# Altium schematic sheet OIS_Anakart.SchDoc
size A2
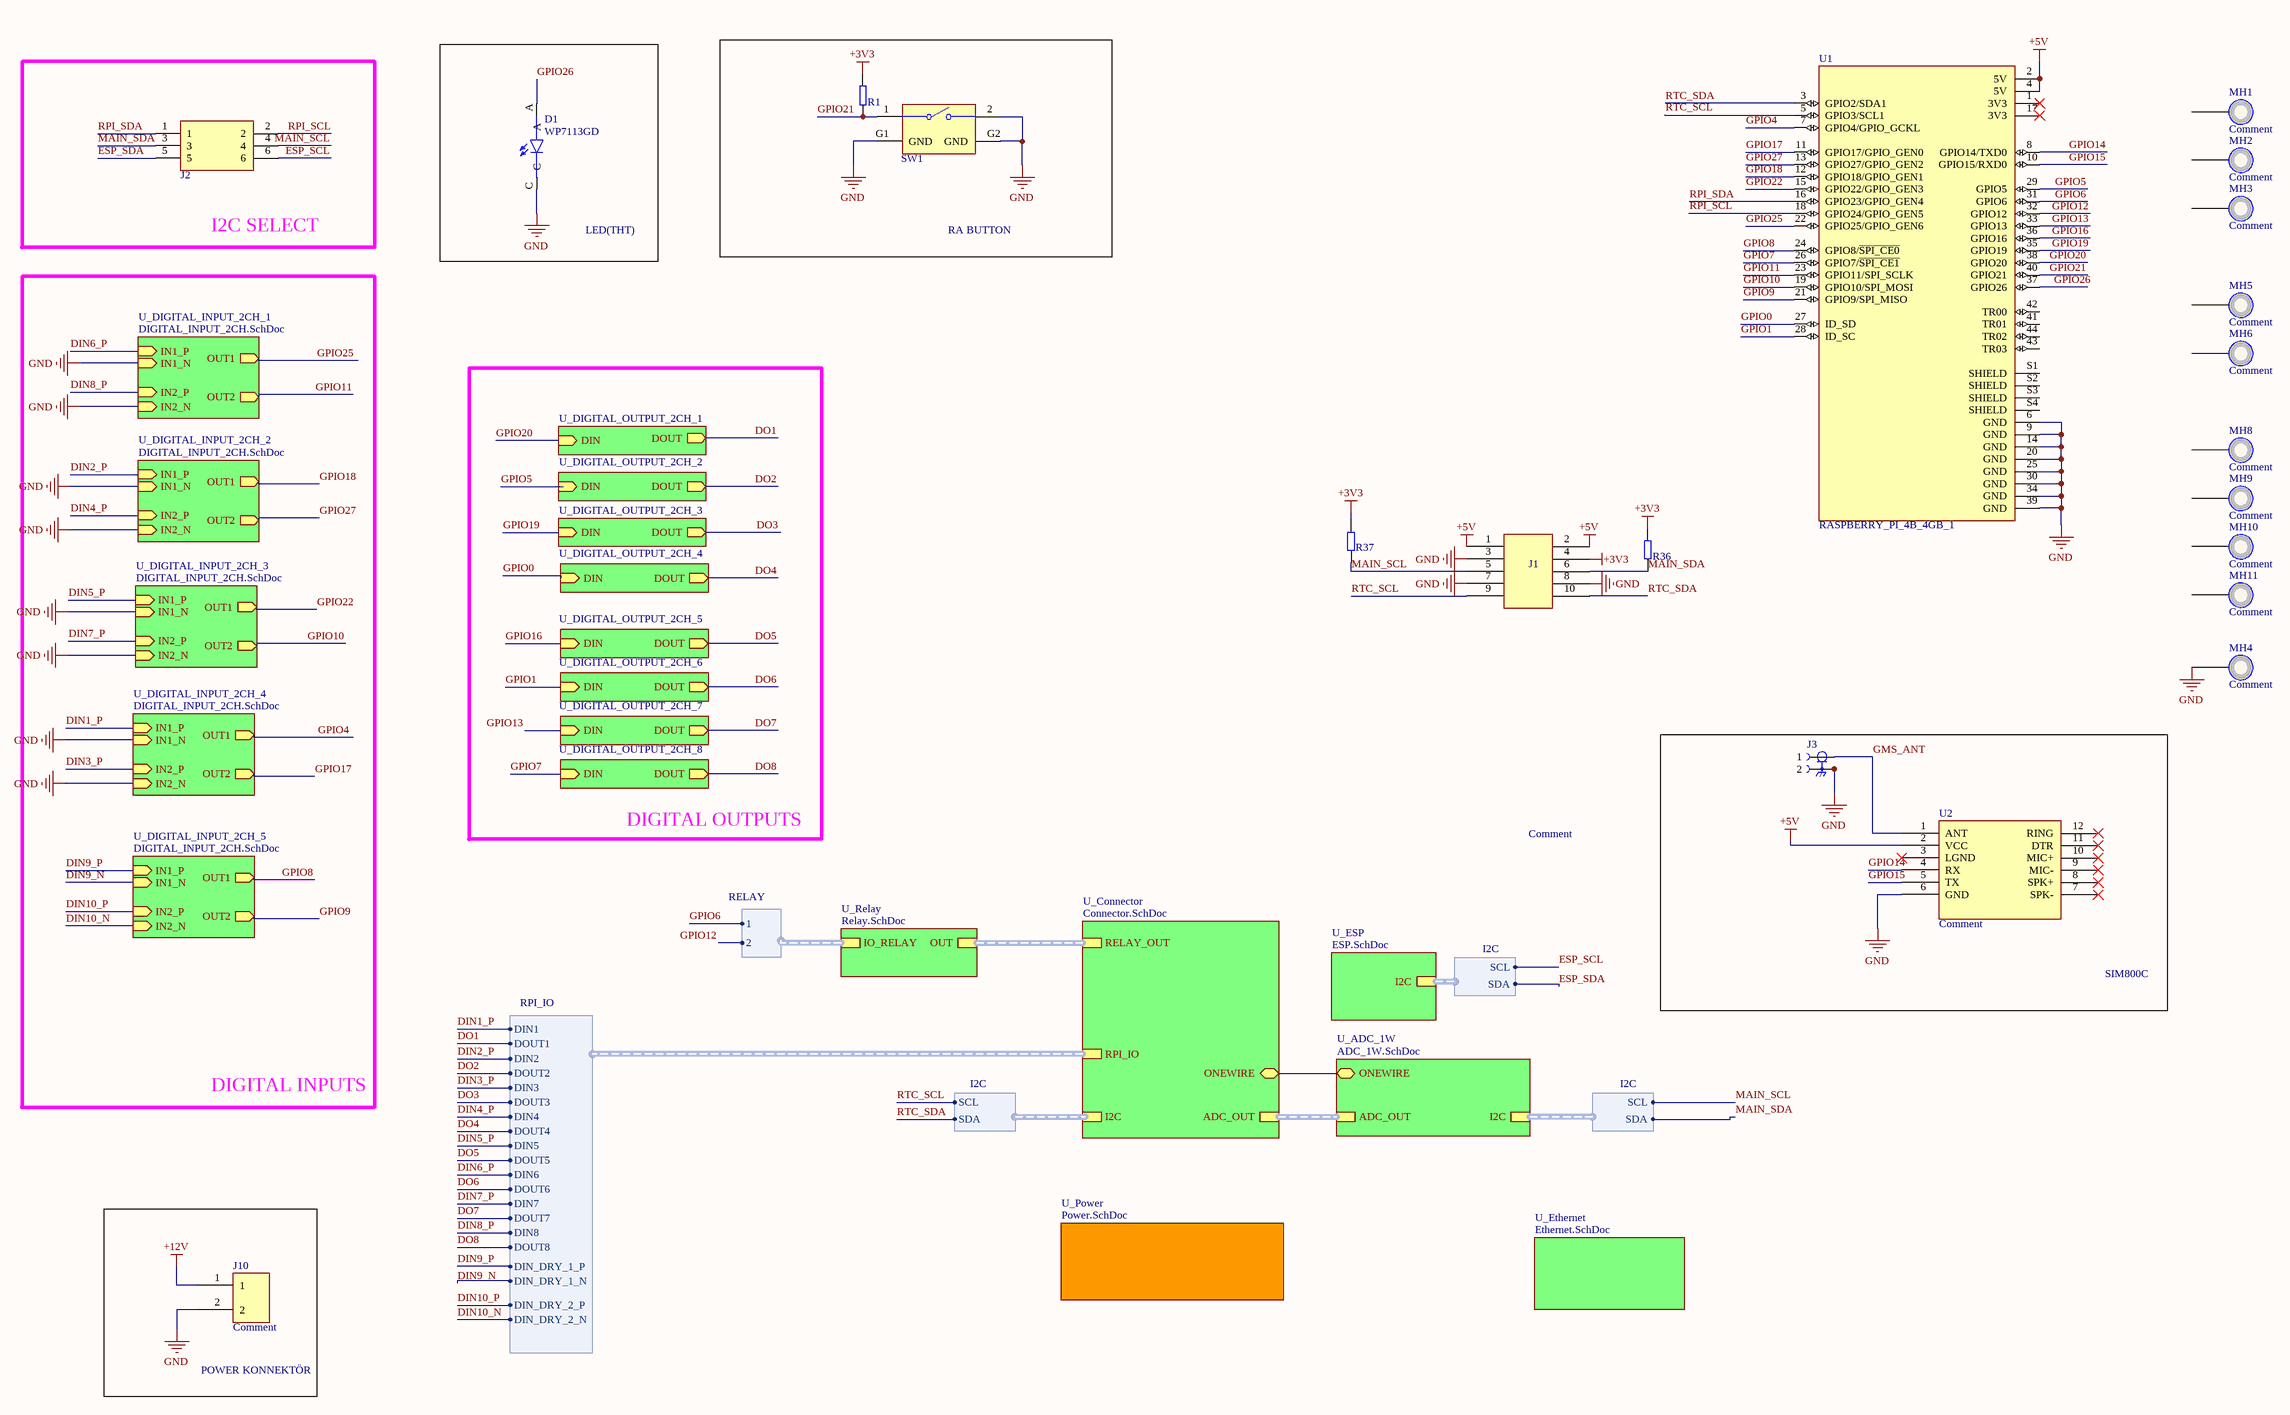
[diagram p0: OIS_Anakart.SchDoc]

## Parts
D1  WP7113GD  [LED_WP7113GD]
J1  Comment  [2.54_5x2P]
J2  GRPB032VWQS-RC  [CONN_6P_1.27MM]  (value not drawn)
J3  RF2-49B-T-00-50-G-HDW  [ADAMTECH_RF2-49B-T-00-50-G-HDW]  (value not drawn)
J10  Comment  [691213510002]
MH1  Comment  [m3_3.2x6]  (no BOM)
MH2  Comment  [m3_3.2x6]  (no BOM)
MH3  Comment  [m3_3.2x6]  (no BOM)
MH4  Comment  [m3_3.2x6]  (no BOM)
MH5  Comment  [m3_3.2x6]  (no BOM)
MH6  Comment  [m3_3.2x6]  (no BOM)
MH8  Comment  [m3_3.2x6]  (no BOM)
MH9  Comment  [m3_3.2x6]  (no BOM)
MH10  Comment  [m3_3.2x6]  (no BOM)
MH11  Comment  [m3_3.2x6]  (no BOM)
R1  1K  [R0402]  (value not drawn)
R36  1K  [R0402]  (value not drawn)
R37  1K  [R0402]  (value not drawn)
SW1  431256083716  [4312560837x6]  (value not drawn)
U1  RASPBERRY_PI_4B_4GB_1  [MODULE_RASPBERRY_PI_4B_4GB_2]
U2  Comment  [SIM800C_EVAL]

## Blocks framed on the sheet
I2C SELECT: J2
LED(THT): D1
RA BUTTON: R1 SW1
SIM800C: J3 U2
POWER KONNEKTÖR: J10

## Sub-sheets
U_ADC_1W = ADC_1W.SchDoc: I2C (harness I2C), ADC_OUT (harness ADC_OUT), ONEWIRE (bidir)
U_Connector = Connector.SchDoc: RELAY_OUT (harness RELAY_OUT), ADC_OUT (harness ADC_OUT), ONEWIRE (bidir), I2C (harness I2C), RPI_IO (harness RPI_IO)
U_DIGITAL_INPUT_2CH_1 = DIGITAL_INPUT_2CH.SchDoc: OUT2 (out), OUT1 (out), IN2_N (in), IN2_P (in), IN1_N (in), IN1_P (in)
U_DIGITAL_INPUT_2CH_2 = DIGITAL_INPUT_2CH.SchDoc: OUT2 (out), OUT1 (out), IN2_N (in), IN2_P (in), IN1_N (in), IN1_P (in)
U_DIGITAL_INPUT_2CH_3 = DIGITAL_INPUT_2CH.SchDoc: OUT2 (out), OUT1 (out), IN2_N (in), IN2_P (in), IN1_N (in), IN1_P (in)
U_DIGITAL_INPUT_2CH_4 = DIGITAL_INPUT_2CH.SchDoc: OUT2 (out), OUT1 (out), IN2_N (in), IN2_P (in), IN1_N (in), IN1_P (in)
U_DIGITAL_INPUT_2CH_5 = DIGITAL_INPUT_2CH.SchDoc: OUT2 (out), OUT1 (out), IN2_N (in), IN2_P (in), IN1_N (in), IN1_P (in)
U_DIGITAL_OUTPUT_2CH_1 = DIGITAL_OUTPUT_2CH.SchDoc: DIN (in), DOUT (out)
U_DIGITAL_OUTPUT_2CH_2 = DIGITAL_OUTPUT_2CH.SchDoc: DIN (in), DOUT (out)
U_DIGITAL_OUTPUT_2CH_3 = DIGITAL_OUTPUT_2CH.SchDoc: DIN (in), DOUT (out)
U_DIGITAL_OUTPUT_2CH_4 = DIGITAL_OUTPUT_2CH.SchDoc: DIN (in), DOUT (out)
U_DIGITAL_OUTPUT_2CH_5 = DIGITAL_OUTPUT_2CH.SchDoc: DIN (in), DOUT (out)
U_DIGITAL_OUTPUT_2CH_6 = DIGITAL_OUTPUT_2CH.SchDoc: DIN (in), DOUT (out)
U_DIGITAL_OUTPUT_2CH_7 = DIGITAL_OUTPUT_2CH.SchDoc: DIN (in), DOUT (out)
U_DIGITAL_OUTPUT_2CH_8 = DIGITAL_OUTPUT_2CH.SchDoc: DIN (in), DOUT (out)
U_ESP = ESP.SchDoc: I2C (harness I2C)
U_Ethernet = Ethernet.SchDoc: no entries
U_Power = Power.SchDoc: no entries
U_Relay = Relay.SchDoc: IO_RELAY (harness RELAY), OUT (harness RELAY_OUT)

## Harnesses
I2C: SCL, SDA
RPI_IO: DIN1, DOUT1, DIN2, DOUT2, DIN3, DOUT3, DIN4, DOUT4, DIN5, DOUT5, DIN6, DOUT6, DIN7, DOUT7, DIN8, DOUT8, DIN_DRY_1_P, DIN_DRY_1_N, DIN_DRY_2_N, DIN_DRY_2_P
RELAY: 2, 1

## Nets
+3V3: J1.4 R1.1 R36.1 R37.1
+5V: J1.1 J1.2 U1.2(5V) U1.4(5V) U2.2(VCC)
+12V: J10.1
GND: D1.C J1.3 J1.7 J1.8 J3.SH1 J3.SH2 J3.SH3 J3.SH4(2) J10.2 MH4.1 SW1.2 SW1.G1(GND) SW1.G2(GND) U1.6(GND) U1.9(GND) U1.14(GND) U1.20(GND) U1.25(GND) U1.30(GND) U1.34(GND) U1.39(GND) U2.6(GND) ; sheet U_DIGITAL_INPUT_2CH_1/IN2_N, sheet U_DIGITAL_INPUT_2CH_1/IN1_N, sheet U_DIGITAL_INPUT_2CH_2/IN2_N, sheet U_DIGITAL_INPUT_2CH_2/IN1_N, sheet U_DIGITAL_INPUT_2CH_3/IN2_N, sheet U_DIGITAL_INPUT_2CH_3/IN1_N, sheet U_DIGITAL_INPUT_2CH_4/IN2_N, sheet U_DIGITAL_INPUT_2CH_4/IN1_N
DIN1_P: sheet U_DIGITAL_INPUT_2CH_4/IN1_P, sheet U_Connector/RPI_IO.DIN1
DIN2_P: sheet U_DIGITAL_INPUT_2CH_2/IN1_P, sheet U_Connector/RPI_IO.DIN2
DIN3_P: sheet U_DIGITAL_INPUT_2CH_4/IN2_P, sheet U_Connector/RPI_IO.DIN3
DIN4_P: sheet U_DIGITAL_INPUT_2CH_2/IN2_P, sheet U_Connector/RPI_IO.DIN4
DIN5_P: sheet U_DIGITAL_INPUT_2CH_3/IN1_P, sheet U_Connector/RPI_IO.DIN5
DIN6_P: sheet U_DIGITAL_INPUT_2CH_1/IN1_P, sheet U_Connector/RPI_IO.DIN6
DIN7_P: sheet U_DIGITAL_INPUT_2CH_3/IN2_P, sheet U_Connector/RPI_IO.DIN7
DIN8_P: sheet U_DIGITAL_INPUT_2CH_1/IN2_P, sheet U_Connector/RPI_IO.DIN8
DIN9_N: sheet U_DIGITAL_INPUT_2CH_5/IN1_N, sheet U_Connector/RPI_IO.DIN_DRY_1_N
DIN9_P: sheet U_DIGITAL_INPUT_2CH_5/IN1_P, sheet U_Connector/RPI_IO.DIN_DRY_1_P
DIN10_N: sheet U_DIGITAL_INPUT_2CH_5/IN2_N, sheet U_Connector/RPI_IO.DIN_DRY_2_N
DIN10_P: sheet U_DIGITAL_INPUT_2CH_5/IN2_P, sheet U_Connector/RPI_IO.DIN_DRY_2_P
DO1: sheet U_DIGITAL_OUTPUT_2CH_1/DOUT, sheet U_Connector/RPI_IO.DOUT1
DO2: sheet U_DIGITAL_OUTPUT_2CH_2/DOUT, sheet U_Connector/RPI_IO.DOUT2
DO3: sheet U_DIGITAL_OUTPUT_2CH_3/DOUT, sheet U_Connector/RPI_IO.DOUT3
DO4: sheet U_DIGITAL_OUTPUT_2CH_4/DOUT, sheet U_Connector/RPI_IO.DOUT4
DO5: sheet U_DIGITAL_OUTPUT_2CH_5/DOUT, sheet U_Connector/RPI_IO.DOUT5
DO6: sheet U_DIGITAL_OUTPUT_2CH_6/DOUT, sheet U_Connector/RPI_IO.DOUT6
DO7: sheet U_DIGITAL_OUTPUT_2CH_7/DOUT, sheet U_Connector/RPI_IO.DOUT7
DO8: sheet U_DIGITAL_OUTPUT_2CH_8/DOUT, sheet U_Connector/RPI_IO.DOUT8
ESP_SCL: J2.6 ; sheet U_ESP/I2C.SCL
ESP_SDA: J2.5 ; sheet U_ESP/I2C.SDA
GMS_ANT: J3.1 U2.1(ANT)
GPIO0: U1.27(ID_SD) ; sheet U_DIGITAL_OUTPUT_2CH_4/DIN
GPIO1: U1.28(ID_SC) ; sheet U_DIGITAL_OUTPUT_2CH_6/DIN
GPIO4: U1.7(GPIO4/GPIO_GCKL) ; sheet U_DIGITAL_INPUT_2CH_4/OUT1
GPIO5: U1.29(GPIO5) ; sheet U_DIGITAL_OUTPUT_2CH_2/DIN
GPIO6: U1.31(GPIO6) ; sheet U_Relay/IO_RELAY.1
GPIO7: U1.26(GPIO7/~{SPI_CE1}) ; sheet U_DIGITAL_OUTPUT_2CH_8/DIN
GPIO8: U1.24(GPIO8/~{SPI_CE0}) ; sheet U_DIGITAL_INPUT_2CH_5/OUT1
GPIO9: U1.21(GPIO9/SPI_MISO) ; sheet U_DIGITAL_INPUT_2CH_5/OUT2
GPIO10: U1.19(GPIO10/SPI_MOSI) ; sheet U_DIGITAL_INPUT_2CH_3/OUT2
GPIO11: U1.23(GPIO11/SPI_SCLK) ; sheet U_DIGITAL_INPUT_2CH_1/OUT2
GPIO12: U1.32(GPIO12) ; sheet U_Relay/IO_RELAY.2
GPIO13: U1.33(GPIO13) ; sheet U_DIGITAL_OUTPUT_2CH_7/DIN
GPIO14: U1.8(GPIO14/TXD0) U2.4(RX)
GPIO15: U1.10(GPIO15/RXD0) U2.5(TX)
GPIO16: U1.36(GPIO16) ; sheet U_DIGITAL_OUTPUT_2CH_5/DIN
GPIO17: U1.11(GPIO17/GPIO_GEN0) ; sheet U_DIGITAL_INPUT_2CH_4/OUT2
GPIO18: U1.12(GPIO18/GPIO_GEN1) ; sheet U_DIGITAL_INPUT_2CH_2/OUT1
GPIO19: U1.35(GPIO19) ; sheet U_DIGITAL_OUTPUT_2CH_3/DIN
GPIO20: U1.38(GPIO20) ; sheet U_DIGITAL_OUTPUT_2CH_1/DIN
GPIO21: R1.2 SW1.1 U1.40(GPIO21)
GPIO22: U1.15(GPIO22/GPIO_GEN3) ; sheet U_DIGITAL_INPUT_2CH_3/OUT1
GPIO25: U1.22(GPIO25/GPIO_GEN6) ; sheet U_DIGITAL_INPUT_2CH_1/OUT1
GPIO26: D1.A U1.37(GPIO26)
GPIO27: U1.13(GPIO27/GPIO_GEN2) ; sheet U_DIGITAL_INPUT_2CH_2/OUT2
MAIN_SCL: J1.5 J2.4 R37.2 ; sheet U_ADC_1W/I2C.SCL
MAIN_SDA: J1.6 J2.3 R36.2 ; sheet U_ADC_1W/I2C.SDA
RPI_SCL: J2.2 U1.18(GPIO24/GPIO_GEN5)
RPI_SDA: J2.1 U1.16(GPIO23/GPIO_GEN4)
RTC_SCL: J1.9 U1.5(GPIO3/SCL1) ; sheet U_Connector/I2C.SCL
RTC_SDA: J1.10 U1.3(GPIO2/SDA1) ; sheet U_Connector/I2C.SDA
(unnamed): sheet U_Connector/ONEWIRE, sheet U_ADC_1W/ONEWIRE

Not connected (* = marked no-connect by the designer): MH1 1; MH2 1; MH3 1; MH5 1; MH6 1; MH8 1; MH9 1; MH10 1; MH11 1; U1 1(3V3)* 17(3V3)* 41(TR01) 42(TR00) 43(TR03) 44(TR02) S1(SHIELD) S2(SHIELD) S3(SHIELD) S4(SHIELD); U2 3(LGND)* 7(SPK-)* 8(SPK+)* 9(MIC-)* 10(MIC+)* 11(DTR)* 12(RING)*

## Buses and harness runs
harness sheet U_ADC_1W/ADC_OUT = sheet U_Connector/ADC_OUT
harness sheet U_Connector/RELAY_OUT = sheet U_Relay/OUT

## Notes on the sheet
- DIGITAL OUTPUTS
- DIGITAL INPUTS

## Library data of the parts
D1 = WP7113GD: Green 568nm LED Indication THT; MF: Kingbright; Que: 013; Price: None; Availability: Unavailable; Package: Radial Kingbright; SnapEDA_Link: https://www.snapeda.com/parts/WP7113GD/Kingbright/view-part/573477/?ref=snap; MP: WP7113GD; Value: *; Part Number: WP7113GD
J1 = CONN10P_5x2P: Que: 104; Part Number: CONN10P_5x2P
J2 = GRPB032VWQS-RC: CONN HEADER SMD 6POS 1.27MM; Manufacturer: Sullins Connector Solutions; Que: 052; Number of Position: 6; Connector Style: Header,Female Pin; Name: Ahmet Kemal Ayyildiz; Part Number: GRPB032VWQS-RC; Mounting Type: Surface Mount; Contact Finish: Gold; Datasheet: https://s3.amazonaws.com/catalogspreads-pdf/PAGE94-95%20.050%20MALE%20HDR%20ST%20RA%20SMT.pdf; Manufacturer Part Number: GRPB032VWQS-RC; Date: 25-01-2022
J3 = 2057-RF2-49B-T-00-50-G-HDW-ND: RF SMA CONNECTOR; MF: Adam Tech; Que: 177; SnapEDA_Link: https://www.snapeda.com/parts/RF2-49B-T-00-50-G-HDW/Adam+Tech/view-part/?ref=snap; Package: None; Value: *; MP: RF2-49B-T-00-50-G-HDW; Check_prices: https://www.snapeda.com/parts/RF2-49B-T-00-50-G-HDW/Adam+Tech/view-part/?ref=eda; Part Number: 2057-RF2-49B-T-00-50-G-HDW-ND
J10 = 2P_508: 5.08 mm _ 2 pins; Part Number: 2P_508; Que: 153
MH1-MH6 MH8-MH11 = M3_Vida: Que: 022; DesignItemID: Mounting Hole; Created On: 13.02.2020; Created By: Recep Aydin; Category: Miscellaneous; Part Number: M3_Vida
R1 R36 R37 = RT0402BRE071KL: RES SMD 1K OHM 0.1% 1/16W 0402; Manufacturer: Yageo; Que: 015; Name: Recep Aydin; Part Number: RT0402BRE071KL; Tolerance: 0.1%; Resistor Type: Thick Film; Package: 0402; Datasheet: https://www.yageo.com/upload/media/product/productsearch/datasheet/rchip/PYu-RT_1-to-0.01_RoHS_L_12.pdf; Manufacturer Part Number: RT0402BRE071KL
SW1 = 431256083716: THT Tact Switch 6x6 mm Right Angled; Manufacturer: Wurth Elektronik; Match Code: WS-TATU; Circuit: SPST-NO; Operation Force: 160g; Rated Current: 50mA; Rated Voltage: 12VDC; Washable: No; Que: 014; ComponentLink1Description: Website Link; ComponentLink1URL: https://www.we-online.com/redexpert/article/431256083716?ad; ComponentLink2Description: Datasheet Link; ComponentLink2URL: https://www.we-online.com/redexpert/spec/431256083716?ad; Manufacturer Part Number: 431256083716; Category: Tact Switches; Mount: Through Hole; Operating Temperature Max: 85°C; Operating Temperature Min: -40°C; Packaging: Bulk; Length: 6mm; Width: 6mm; Height: 8.35mm; Contact Material: Stainless Steel; Contact Plating: Silver; Terminal Material: Copper Alloy; Terminal Plating: Silver; Part Number: 431256083716
U1 = MODULE_RASPBERRY_PI_4B_4GB THT CONNECTOR: MODULE_RASPBERRY_PI_4B_4GB; MF: Raspberry Pi; MP: RASPBERRY PI 4B/4GB; Que: 040; Price: None; Check_prices: https://www.snapeda.com/parts/RASPBERRY%20PI%204B/4GB/Raspberry+Pi/view-part/?ref=eda; Value: *; Purchase-URL: https://pricing.snapeda.com/search/part/RASPBERRY PI 4B/4GB/?ref=eda; Availability: In Stock; SnapEDA_Link: https://www.snapeda.com/parts/RASPBERRY%20PI%204B/4GB/Raspberry+Pi/view-part/?ref=snap; Package: None; Part Number: MODULE_RASPBERRY_PI_4B_4GB THT CONNECTOR
U2 = SIM800C_EVAL: Que: 042; Part Number: SIM800C_EVAL